# EAGLE design MicroFans (EAGLE 7.1.0)
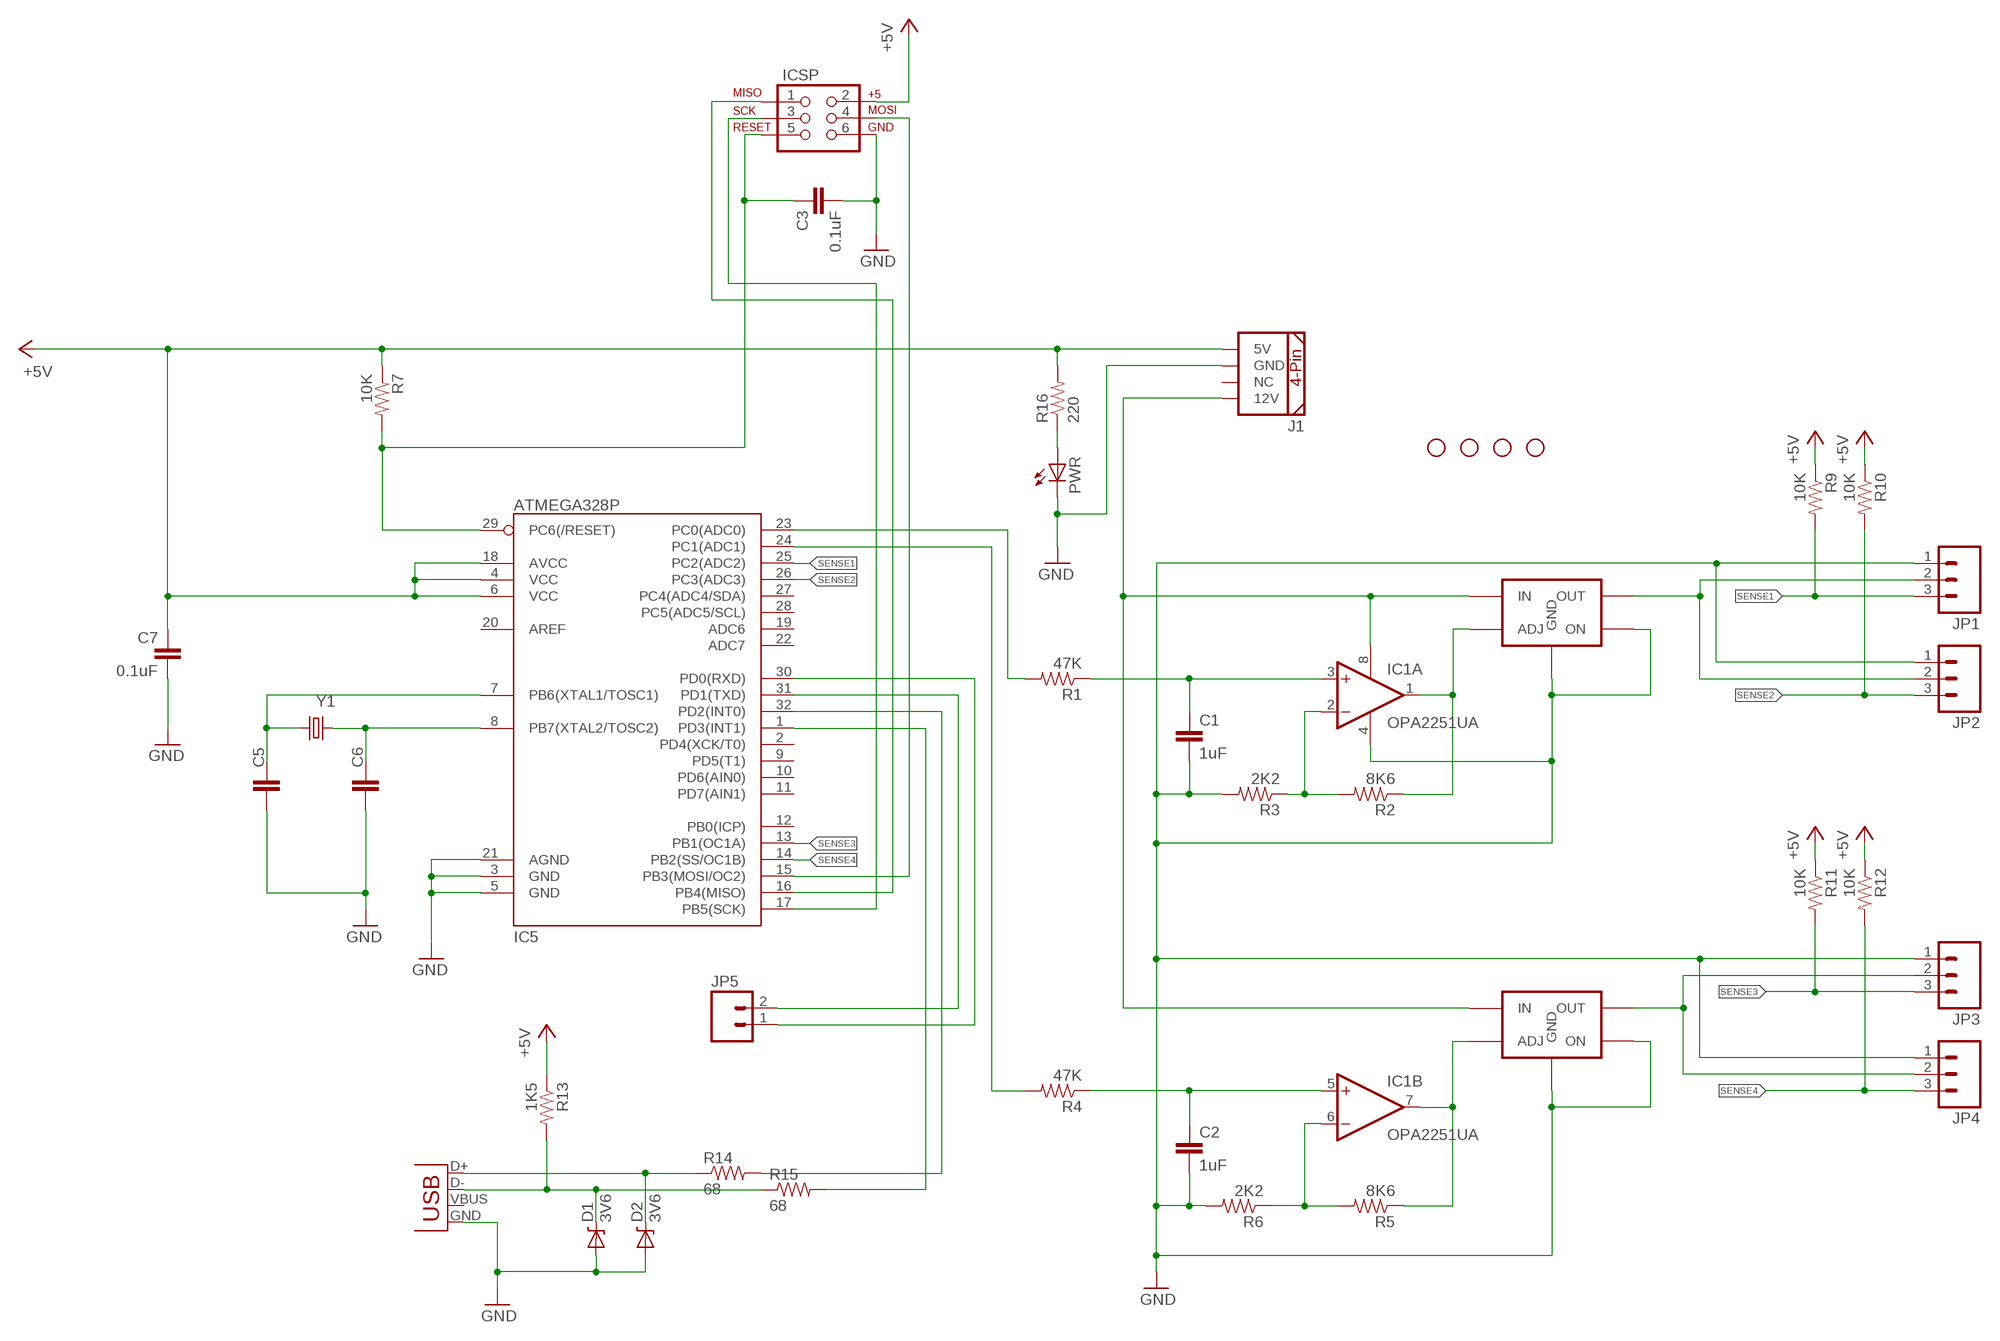
[diagram p0: schematic, sheet 1]

## Parts
C1  1uF  CAP0805  [0805]
C2  1uF  CAP0805  [0805]
C3  0.1uF  CAP0805  [0805]
C5  .22uF  CAP0805  [0805]
C6  .22uF  CAP0805  [0805]
C7  0.1uF  CAP0805  [0805]
D1  3V6  DIODE-ZENER-BZT52  [SOD-323]
D2  3V6  DIODE-ZENER-BZT52  [SOD-323]
HOLE1  STAND-OFF  [STAND-OFF]
HOLE2  STAND-OFF  [STAND-OFF]
HOLE3  STAND-OFF  [STAND-OFF]
HOLE4  STAND-OFF  [STAND-OFF]
IC1  OPA2251UA  [SO08]
IC3  LM2941TO220-V  [TO220-51]
IC4  LM2941TO220-V  [TO220-51]
IC5  ATMEGA328P  ATMEGA328_SMT  [TQFP32-08]
ICSP  AVR_SPI_PRG_6PTH  [2X3]
J1  COMPUTER-PERIPHERAL-POWERVERTICAL  [COMPUTER-PERIPHERAL-POWER]
JP1  M03POLAR  [MOLEX-1X3]
JP2  M03POLAR  [MOLEX-1X3]
JP3  M03POLAR  [MOLEX-1X3]
JP4  M03POLAR  [MOLEX-1X3]
JP5  M02PTH  [1X02]
PWR  LED1206  [LED-1206]
R1  47K  RESISTOR0805-RES  [0805]
R2  8K6  RESISTOR0805-RES  [0805]
R3  2K2  RESISTOR0805-RES  [0805]
R4  47K  RESISTOR0805-RES  [0805]
R5  8K6  RESISTOR0805-RES  [0805]
R6  2K2  RESISTOR0805-RES  [0805]
R7  10K  RESISTOR0805-RES  [0805]
R9  10K  RESISTOR0805-RES  [0805]
R10  10K  RESISTOR0805-RES  [0805]
R11  10K  RESISTOR0805-RES  [0805]
R12  10K  RESISTOR0805-RES  [0805]
R13  1K5  RESISTOR0805-RES  [0805]
R14  68  RESISTOR0805-RES  [0805]
R15  68  RESISTOR0805-RES  [0805]
R16  220  RESISTOR0805-RES  [0805]
USB  USB-A-SMD  [USB-A-S-NOSILK-FEMALE]
Y1  16MHZ  CRYSTALHC49US  [HC49US]

## Nets
+5V: C7.1 IC5.4(VCC) IC5.6(VCC) IC5.18(AVCC) ICSP.2 J1.5V R7.1 R9.1 R10.1 R11.1 R12.1 R13.1 R16.2
+12V: IC1.8(A:V+) IC3.4(IN) IC4.4(IN) J1.12V
D+: D2.1(C) R14.1 USB.D+
D-: D1.1(C) R13.2 R15.1 USB.D-
GND: C1.2 C2.2 C3.2 C5.2 C6.2 C7.2 D1.2(A) D2.2(A) IC1.4(A:V-) IC3.2(ON) IC3.3(GND) IC4.2(ON) IC4.3(GND) IC5.3(GND) IC5.5(GND) IC5.21(AGND) ICSP.6 J1.GND JP1.1 JP2.1 JP3.1 JP4.1 PWR.C R3.2 R6.2 USB.GND
N$1: IC5.30(PD0(RXD)) JP5.1
N$2: IC1.1(A:OUT) IC3.1(ADJ) R2.1
N$3: IC5.16(PB4(MISO)) ICSP.1
N$4: IC5.31(PD1(TXD)) JP5.2
N$5: IC5.23(PC0(ADC0)) R1.2
N$6: C5.1 IC5.7(PB6(XTAL1/TOSC1)) Y1.2
N$7: PWR.A R16.1
N$8: IC3.5(OUT) JP1.2 JP2.2
N$9: C6.1 IC5.8(PB7(XTAL2/TOSC2)) Y1.1
N$10: IC5.17(PB5(SCK)) ICSP.3
N$11: IC5.15(PB3(MOSI/OC2)) ICSP.4
N$12: IC5.24(PC1(ADC1)) R4.2
N$13: IC4.5(OUT) JP3.2 JP4.2
N$14: IC1.7(B:OUT) IC4.1(ADJ) R5.1
N$15: C1.1 IC1.3(A:+IN) R1.1
N$16: IC1.2(A:-IN) R2.2 R3.1
N$17: C2.1 IC1.5(B:+IN) R4.1
N$18: IC1.6(B:-IN) R5.2 R6.1
N$29: IC5.32(PD2(INT0)) R14.2
N$30: IC5.1(PD3(INT1)) R15.2
RESET: C3.1 IC5.29(PC6(/RESET)) ICSP.5 R7.2
SENSE1: IC5.25(PC2(ADC2)) JP1.3 R9.2
SENSE2: IC5.26(PC3(ADC3)) JP2.3 R10.2
SENSE3: IC5.13(PB1(OC1A)) JP3.3 R11.2
SENSE4: IC5.14(PB2(SS/OC1B)) JP4.3 R12.2
Unconnected: IC5.2(PD4(XCK/T0)) IC5.9(PD5(T1)) IC5.10(PD6(AIN0)) IC5.11(PD7(AIN1)) IC5.12(PB0(ICP)) IC5.19(ADC6) IC5.20(AREF) IC5.22(ADC7) IC5.27(PC4(ADC4/SDA)) IC5.28(PC5(ADC5/SCL)) J1.NC USB.VBUS

## Library data of the parts
C1-C3 C5-C7 = SparkFun-Capacitors:CAP: Capacitor Standard 0603 ceramic capacitor, and 0.1" leaded capacitor.
D1 D2 = SparkFun-DiscreteSemi:DIODE-ZENER: Zener Diode Production Part - 8199 3.4V Zener Voltage
HOLE1-HOLE4 = SparkFun:STAND-OFF: Stand Off This is the mechanical footprint for a #4 phillips button head screw. Use the keepout ring to avoid running the screw head into surrounding components. SKU : PRT-00447
IC1 = linear:OPA2*: Dual Operational Amplifier Low Power, Single-Supply, Rail-To-Rail Operational Amplifier Source: http://focus.ti.com/lit/ds/symlink/opa2345.pdf http://focus.ti.com .. opa241.pdf http://focus.ti.com/lit/ds/symlink/opa2134.pdf
IC3 IC4 = lm2941:LM2941
IC5 = SparkFun-DigitalIC:ATMEGA328_SMT: 32-Pin Atmega328 part Commonly used on Arduino compatible boards Available in QFP and QFN packages TQFP is IC-09069 QFN is non-stock; PROD_ID: IC-09069
ICSP = SparkFun-Connectors:AVR_SPI_PRG_6: AVR ISP 6 Pin This is the reduced ISP connector for AVR programming. Common on Arduino. This footprint will take up less PCB space and can be used with a 10-pin to 6-pin adapter such as SKU: BOB-08508
J1 = SparkFun-Connectors:COMPUTER-PERIPHERAL-POWER
JP1-JP4 = SparkFun-Connectors:M03: Header 3 Standard 3-pin 0.1" header. Use with straight break away headers (SKU : PRT-00116), right angle break away headers (PRT-00553), swiss pins (PRT-00743), machine pins (PRT-00117), and female headers (PRT-00115). Molex polarized connector foot print use with SKU : PRT-08232 with associated crimp pins and housings.
JP5 = SparkFun-Connectors:M02: Header 2 Standard 2-pin 0.1" header. Use with straight break away headers (SKU : PRT-00116), right angle break away headers (PRT-00553), swiss pins (PRT-00743), machine pins (PRT-00117), and female headers (PRT-00115). Molex polarized connector foot print use with SKU : PRT-08233 with associated crimp pins and housings.
PWR = SparkFun-LED:LED: LEDs Standard schematic elements and footprints for 5mm, 3mm, 1206, and 0603 sized LEDs. 5mm - Spark Fun Electronics SKU : COM-00529 (and others)
R1-R7 R9-R16 = SparkFun-Resistors:RESISTOR: Resistor Basic schematic elements and footprints for 0603, 1206, and PTH resistors.
USB = SparkFun-Connectors:USB: USB Connectors USB-B-PTH is fully proven SKU : PRT-00139/CONN-08278 USB-miniB is fully proven SKU : PRT-00587 USB-A-PCB is untested. USB-A-H is throughly reviewed, but untested. Spark Fun Electronics SKU : PRT-00437 USB-B-SMT is throughly reviewed, but untested. Needs silkscreen touching up. USB-A-S has not been used/tested USB-MB-H has not been used/tested USB-MICROB has been used. CONN-09505; PROD_ID: CONN-09520
Y1 = SparkFun-FreqCtrl:CRYSTAL: Various standard crystals. Proven footprints. Spark Fun Electronics SKU : COM-00534

## Net classes
1 power: width 0.61 mm

## Board
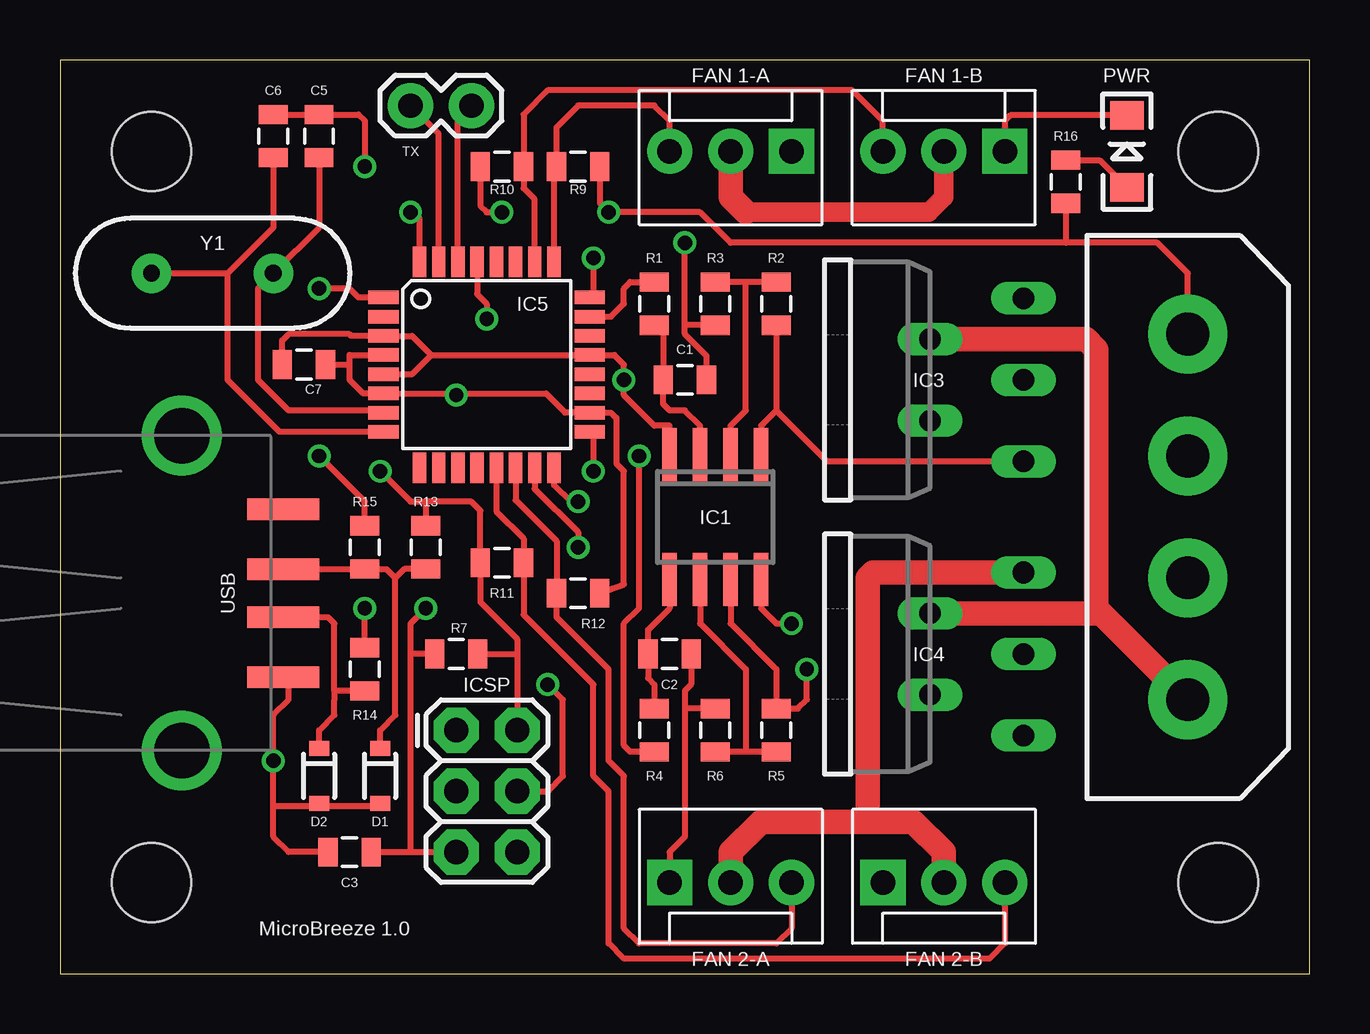
[diagram p1: board, top side]
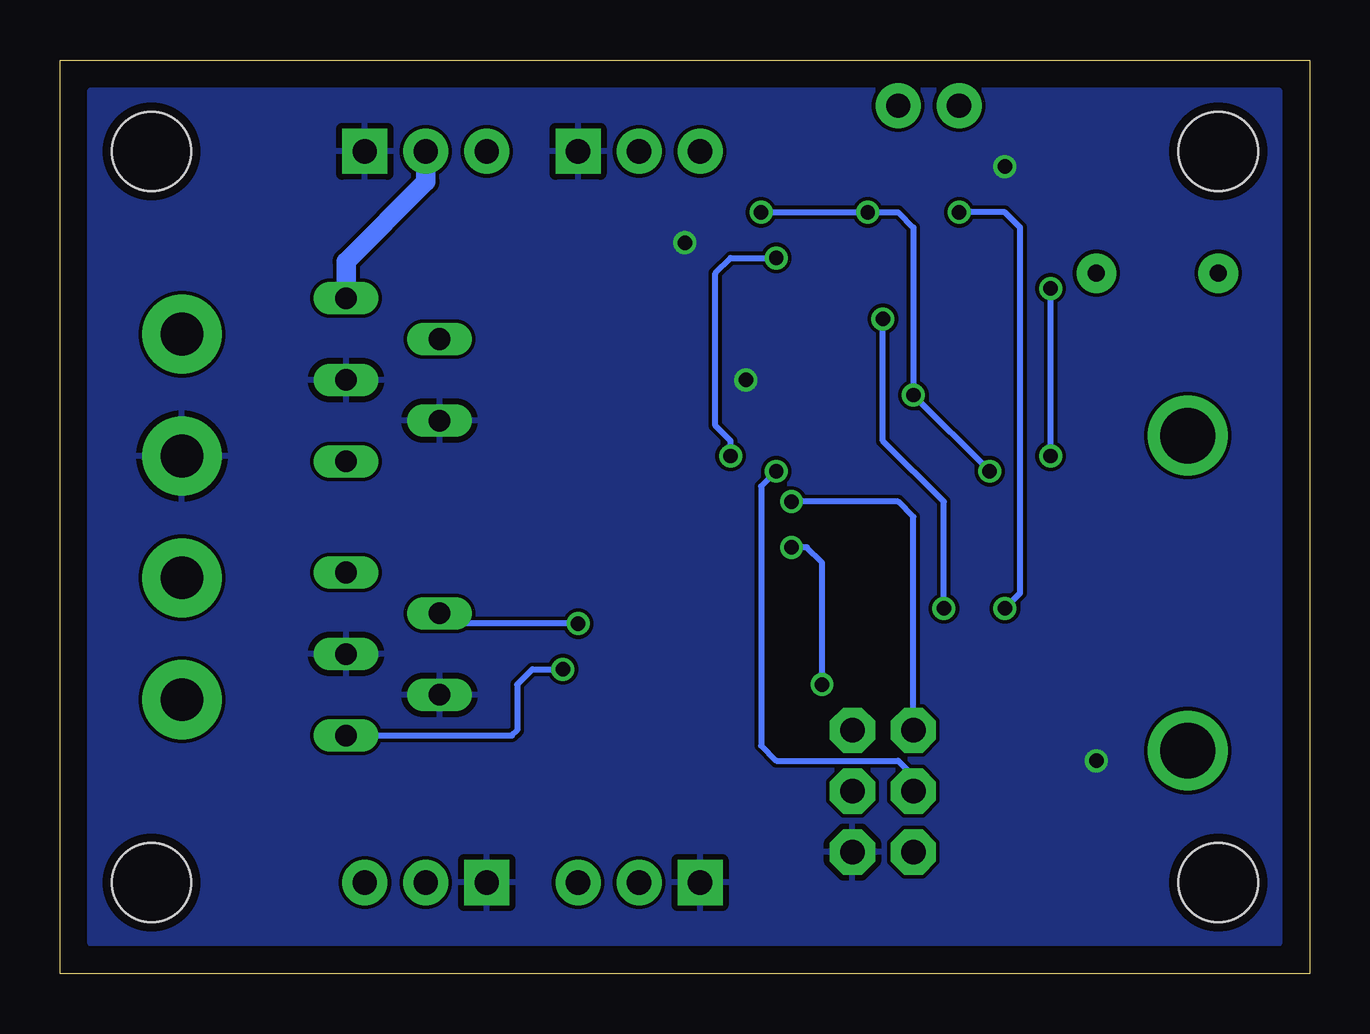
[diagram p2: board, bottom side, seen from below]

Size 52.07 x 38.1 mm. Coordinates in mm from the lower left corner, seen from the top.
Outline: 0,0 52.07,0 52.07,38.1 0,38.09 0,0
Copper layers (1*16): Top 0.0356mm / dielectric 1.5011mm / Bottom 0.0356mm
Design rules "LaenPCBOrder *": minimum track width 6mil, minimum drill 13mil, track to track 6mil, track to pad 6mil, pad to pad 6mil, via to via 6mil, smd to smd 6mil, copper to edge 15mil, drill to drill 6mil, minimum pad ring 7mil, minimum via ring 7mil, stop-mask expansion 3mil, vias tented up to drill 0mil, thermal gap 10mil

### Footprints (pad centres in the part's own frame; a part is rotated, then mirrored left to right if it is on the bottom)
0805 = smd 0.8 x 1.2: 1 -0.9,0; 2 0.9,0
SOD-323 = smd 0.63 x 0.83: 1 -1.15,0; 2 1.15,0
STAND-OFF = hole 3.302: 0,0
SO08 = smd 0.6 x 2.2: 1 -1.905,-2.6; 2 -0.635,-2.6; 3 0.635,-2.6; 4 1.905,-2.6; 5 1.905,2.6; 6 0.635,2.6; 7 -0.635,2.6; 8 -1.905,2.6
TO220-51 = drill 0.9 long: 1 -3.4,-8.4; 2 -1.7,-4.5; 3 0,-8.4; 4 1.7,-4.5; 5 3.4,-8.4
TQFP32-08 = smd 1.27 x 0.559: 1 -4.293,2.8; 2 -4.293,2; 3 -4.293,1.2; 4 -4.293,0.4; 5 -4.293,-0.4; 6 -4.293,-1.2; 7 -4.293,-2; 8 -4.293,-2.8; 17 4.293,-2.8; 18 4.293,-2; 19 4.293,-1.2; 20 4.293,-0.4; 21 4.293,0.4; 22 4.293,1.2; 23 4.293,2; 24 4.293,2.8 | smd 0.559 x 1.27: 9 -2.8,-4.293; 10 -2,-4.293; 11 -1.2,-4.293; 12 -0.4,-4.293; 13 0.4,-4.293; 14 1.2,-4.293; 15 2,-4.293; 16 2.8,-4.293; 25 2.8,4.293; 26 2,4.293; 27 1.2,4.293; 28 0.4,4.293; 29 -0.4,4.293; 30 -1.2,4.293; 31 -2,4.293; 32 -2.8,4.293
2X3 = drill 1.016 pad 1.88 octagon: 1 0,0; 2 0,2.54; 3 2.54,0; 4 2.54,2.54; 5 5.08,0; 6 5.08,2.54
COMPUTER-PERIPHERAL-POWER = drill 1.778 pad 3.302: 5V 7.62,0; 12V -7.62,0; GND 2.54,0; NC -2.54,0
MOLEX-1X3 = drill 1.016 pad 1.88 square: 1 0,0 | drill 1.016 pad 1.88: 2 2.54,0; 3 5.08,0
1X02 = drill 1.016 pad 1.88: 1 0,0; 2 2.54,0
LED-1206 = smd 1.2 x 1.4: A -1.5,0; C 1.5,0
USB-A-S-NOSILK-FEMALE = smd 3 x 0.9: D+ 4.212,-1; D- 4.212,1; GND 4.212,-3.5; VBUS 4.212,3.5 | drill 2.311: P$5 0,-6.566; P$6 0,6.566
HC49US = drill 0.7 pad 1.651: 1 -2.54,0; 2 2.54,0

### Placement (x,y rotation side)
C1  26.04,24.77 0 top
C2  25.4,13.34 0 top
C3  12.06,5.08 180 top
C5  10.79,34.92 90 top
C6  8.89,34.92 90 top
C7  10.16,25.4 180 top
D1  13.34,8.26 270 top
D2  10.79,8.26 270 top
HOLE1  3.81,3.81 0 top
HOLE2  48.26,3.81 0 top
HOLE3  3.81,34.29 0 top
HOLE4  48.26,34.29 0 top
IC1  27.3,19.05 180 top
IC3  31.75,24.77 90 top
IC4  31.75,13.34 90 top
IC5  17.78,25.4 0 top
ICSP  16.51,10.16 270 top
J1  46.99,19.05 90 top
JP1  30.48,34.29 180 top
JP2  39.37,34.29 180 top
JP3  34.29,3.81 0 top
JP4  25.4,3.81 0 top
JP5  17.14,36.2 180 top
PWR  44.45,34.29 90 top
R1  24.77,27.94 90 top
R2  29.84,27.94 90 top
R3  27.3,27.94 270 top
R4  24.77,10.16 270 top
R5  29.84,10.16 270 top
R6  27.3,10.16 90 top
R7  16.51,13.34 180 top
R9  21.59,33.66 180 top
R10  18.41,33.66 0 top
R11  18.41,17.14 0 top
R12  21.59,15.88 180 top
R13  15.24,17.78 270 top
R14  12.7,12.7 90 top
R15  12.7,17.78 90 top
R16  41.91,33.02 270 top
USB  5.08,15.88 0 top
Y1  6.35,29.21 0 top

### Tracks (layer width: path | path; a pad name or v marks a point on that pad's centre or on a via)
+5V  (via drill 0.6)
  Top 0.254: 12.06,25.4 12.06,24.77 12.63,24.2 IC5.6 16.51,24.2 | 12.06,25.4 12.06,25.8 IC5.4 | 16.51,24.2 20.25,24.2 21.05,23.4 IC5.18 22.95,23.4 23.18,23.18 23.18,21.27 23.5,20.95 23.5,16.25 R12.1 | J1.5V 46.99,29.21 45.72,30.48 41.91,30.48 | 41.91,30.48 27.94,30.48 26.67,31.75 v22.86,31.75 22.49,32.12 R9.1 | R16.2 41.91,30.48 | C7.1 12.06,25.4 | v16.51,24.13 16.51,24.2 | v13.34,20.95 14.61,19.68 15.24,19.68 | 15.24,19.68 R13.1 | 15.24,19.68 17.14,19.68 17.52,19.32 R11.1 17.52,15.51 19.05,13.97 19.05,13.34 | 19.05,13.34 ICSP.2 | R7.1 19.05,13.34 | R10.1 17.52,32.02 17.78,31.75 v18.41,31.75
  Bottom 0.254: v22.86,31.75 v18.41,31.75 17.14,31.75 16.51,31.11 v16.51,24.13 v13.34,20.95
+12V  (via drill 0.6)
  Top 0.254: IC1.8 29.21,15.24 29.84,14.61 v30.48,14.61
  Top 1.016: J1.12V 43.38,15.04 43.18,15.04 | 43.18,15.04 IC4.4 | IC3.4 42.75,26.46 43.18,26.04 43.18,15.04
  Bottom 0.254: v30.48,14.61 35.82,14.61 IC4.4
D+
  Top 0.254: D2.1 10.79,10.16 11.43,10.79 11.43,11.43 11.43,11.8 | 11.43,11.8 11.43,14.61 11.16,14.88 USB.D+ | R14.1 11.43,11.8
D-
  Top 0.254: D1.1 13.34,10.16 13.97,10.79 13.97,16.51 | USB.D- R15.1 13.6,16.88 13.97,16.51 | R13.2 14.34,16.88 13.97,16.51
GND  (via drill 0.6)
  Top 0.254: 15.47,25.8 14.68,26.6 IC5.3 12.13,26.6 12.06,26.67 9.53,26.67 9.26,26.41 C7.2 | IC5.5 14.68,25 15.47,25.8 | C6.2 C5.2 12.44,35.83 12.7,35.56 v12.7,33.66 | PWR.C 39.6,35.79 39.37,35.56 JP2.1 | 26.04,27.04 26.04,26.67 26.93,25.77 C1.2 | 26.04,27.04 v26.04,30.48 | R3.2 26.04,27.04 | C2.2 26.3,12.06 26.04,11.8 26.04,11.06 | R6.2 26.04,11.06 | C3.2 9.53,5.08 8.89,5.71 8.89,6.99 | 8.89,6.99 v8.89,8.89 8.89,10.79 9.53,11.43 9.53,12.14 USB.GND | 15.47,25.8 IC5.21 23.09,25.8 23.5,25.4 v23.5,24.77 23.5,24.13 24.77,22.86 25.4,22.86 IC1.4 | 26.04,11.06 26.04,5.71 25.4,5.08 JP4.1 | D2.2 10.68,6.99 | 10.68,6.99 8.89,6.99 | 10.68,6.99 13.21,6.99 arc90 D1.2
  pour Bottom: 1.27,36.83 1.27,1.27 50.8,1.27 50.8,36.83
N$1
  Top 0.254: IC5.30 16.58,35.63 JP5.1
N$2
  Top 0.254: R2.1 29.84,23.5 | 29.84,23.5 29.21,22.86 IC1.1 | IC3.1 31.98,21.36 29.84,23.5
N$3  (via drill 0.6)
  Top 0.254: IC5.16 20.58,20.38 21.27,19.68 v21.59,19.68
  Bottom 0.254: ICSP.1 16.51,19.05 17.14,19.68 v21.59,19.68
N$4
  Top 0.254: IC5.31 15.78,35.02 JP5.2
N$5
  Top 0.254: IC5.23 22.95,27.4 23.5,27.94 23.5,28.57 23.76,28.84 R1.2
N$6
  Top 0.254: IC5.7 13.39,23.5 9.53,23.5 8.26,24.77 8.26,28.57 Y1.2 10.79,31.11 C5.1
N$7
  Top 0.254: R16.1 43.32,33.92 PWR.A
N$8
  Top 0.813: 28.57,31.75 36.2,31.75 36.83,32.38 JP2.2
  Top 1.016: JP1.2 27.94,32.38 28.57,31.75
  Bottom 0.813: JP2.2 36.83,33.02 40.15,29.7 IC3.5
N$9
  Top 0.254: IC5.8 9.15,22.6 6.99,24.77 6.99,29.21 | C6.1 8.89,31.11 6.99,29.21 | Y1.1 6.99,29.21
N$10  (via drill 0.6)
  Top 0.254: IC5.17 22.23,22.45 v22.23,20.95
  Bottom 0.254: v22.23,20.95 22.86,20.32 22.86,9.53 22.23,8.89 17.14,8.89 16.51,8.26 ICSP.3
N$11  (via drill 0.6)
  Top 0.254: ICSP.4 20.32,7.62 20.95,8.26 20.95,11.43 v20.32,12.06 | IC5.15 19.78,20.23 21.59,18.41 v21.59,17.78
  Bottom 0.254: v20.32,12.06 20.32,17.14 20.95,17.78 v21.59,17.78
N$12  (via drill 0.6)
  Top 0.254: R4.2 23.76,9.26 23.5,9.53 23.5,14.61 24.13,15.24 v24.13,21.59 | v22.23,29.84 22.23,28.35 IC5.24
  Bottom 0.254: v22.23,29.84 24.13,29.84 24.77,29.21 24.77,22.86 24.13,22.23 v24.13,21.59
N$13
  Top 1.016: JP3.2 36.83,5.08 35.56,6.35 33.66,6.35 | 33.66,6.35 29.21,6.35 27.94,5.08 JP4.2 | 33.66,6.35 33.66,16.51 33.88,16.73 IC4.5
N$14  (via drill 0.6)
  Top 0.254: IC1.7 27.94,14.61 29.84,12.7 R5.1 30.75,11.06 31.11,11.43 v31.11,12.7
  Bottom 0.254: v31.11,12.7 32.38,12.7 33.02,12.06 33.02,10.16 33.24,9.94 IC4.1
N$15
  Top 0.254: C1.1 25.4,24.77 | R1.1 25.14,26.67 C1.1 | IC1.3 26.67,22.86 26.04,23.5 25.4,23.5 25.14,23.76 C1.1
N$16
  Top 0.254: R2.2 28.57,28.84 | 28.57,28.84 R3.1 | IC1.2 27.94,22.86 28.57,23.5 28.57,28.84
N$17
  Top 0.254: IC1.5 25.4,15.24 24.5,14.34 C2.1 24.5,12.33 24.77,12.06 R4.1
N$18
  Top 0.254: R5.2 28.57,9.26 | 28.57,9.26 R6.1 | IC1.6 26.67,14.61 28.57,12.7 28.57,9.26
N$29  (via drill 0.6)
  Top 0.254: IC5.32 14.98,31.49 v14.61,31.75 | R14.2 v12.7,15.24
  Bottom 0.254: v14.61,31.75 12.7,31.75 12.06,31.11 12.06,15.88 v12.7,15.24
N$30  (via drill 0.6)
  Top 0.254: IC5.1 12.44,28.2 12.06,28.57 v10.79,28.57 | R15.2 12.7,19.68 v10.79,21.59
  Bottom 0.254: v10.79,21.59 v10.79,28.57
RESET  (via drill 0.6)
  Top 0.254: IC5.29 17.38,28.34 17.78,27.94 v17.78,27.3 | 14.61,5.08 14.61,13.34 | 14.61,13.34 14.61,14.61 v15.24,15.24 | R7.2 14.61,13.34 | C3.1 14.61,5.08 | 14.61,5.08 ICSP.5
  Bottom 0.254: v17.78,27.3 17.78,22.23 15.24,19.68 v15.24,15.24
SENSE1
  Top 0.254: JP1.3 25.4,35.56 24.77,36.2 21.59,36.2 20.69,35.3 R9.2 20.58,33.55 IC5.25
SENSE2
  Top 0.254: JP2.3 34.29,35.56 33.02,36.83 20.32,36.83 19.32,35.83 R10.2 19.32,32.76 19.78,32.29 IC5.26
SENSE3
  Top 0.254: IC5.13 18.18,19.29 19.32,18.15 R11.2 19.32,14.97 22.23,12.06 22.23,8.26 22.86,7.62 22.86,1.27 23.5,0.64 38.73,0.64 39.37,1.27 JP3.3
SENSE4
  Top 0.254: JP4.3 30.48,1.91 29.84,1.27 24.13,1.27 23.5,1.91 23.5,8.26 22.86,8.89 22.86,12.7 20.69,14.87 R12.2 20.69,18.05 18.98,19.75 IC5.14

### Text on the board
tNames: FAN 1-A | FAN 1-B | FAN 2-A | FAN 2-B
tSilk: TX | MicroBreeze 1.0